# EAGLE design Mega_Shield-cjd (EAGLE 7.5.0)
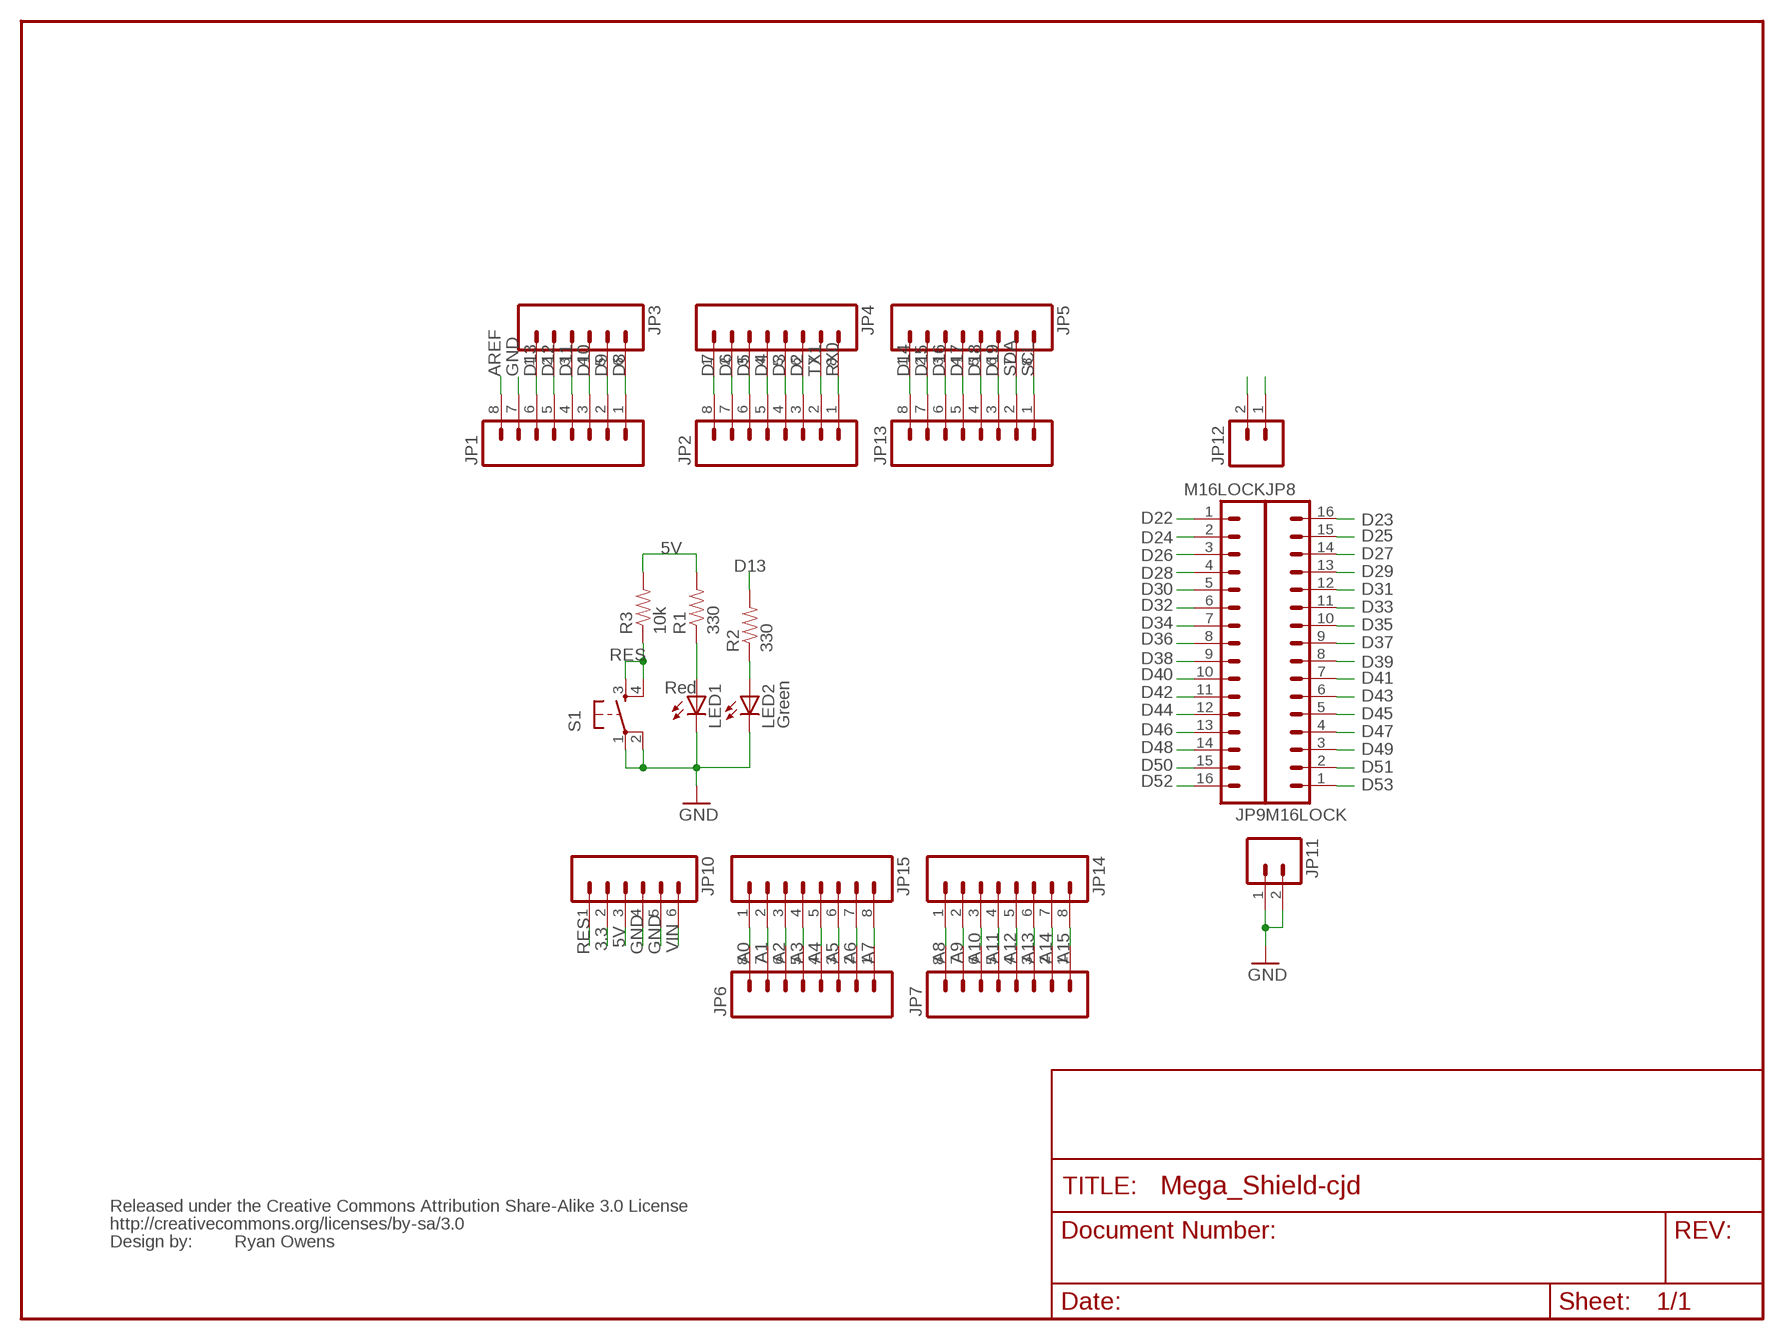
[diagram p0: schematic, sheet 1]

## Parts
JP1  M081X08_LOCK_NO_PIN1  [1X08_LOCK_NO_PIN1]
JP2  M081X08_LOCK_NO_PIN1  [1X08_LOCK_NO_PIN1]
JP3  M06NO_SILK_FEMALE_PTH  [1X06_NO_SILK]
JP4  M08NO_SILK_FEMALE_PTH  [1X08_NO_SILK]
JP5  M08NO_SILK_FEMALE_PTH  [1X08_NO_SILK]
JP6  M08NO_SILK_FEMALE_PTH  [1X08_NO_SILK]
JP7  M08NO_SILK_FEMALE_PTH  [1X08_NO_SILK]
JP8  M16LOCK  [1X16_LOCK]
JP9  M16LOCK  [1X16_LOCK]
JP10  M06LOCK  [1X06_LOCK]
JP11  M02LOCK  [1X02_LOCK]
JP12  M02LOCK  [1X02_LOCK]
JP13  M081X08_LOCK_NO_PIN1  [1X08_LOCK_NO_PIN1]
JP14  M081X08_LOCK_NO_PIN1  [1X08_LOCK_NO_PIN1]
JP15  M081X08_LOCK_NO_PIN1  [1X08_LOCK_NO_PIN1]
LED1  Red  LED5MM  [LED5MM]
LED2  Green  LED5MM  [LED5MM]
R1  330  RESISTORPTH1  [AXIAL-0.3]
R2  330  RESISTORPTH1  [AXIAL-0.3]
R3  10k  RESISTORPTH1  [AXIAL-0.3]
S1  TAC_SWITCHPTH  [TACTILE-PTH]
U$2  CREATIVE_COMMONS  [CREATIVE_COMMONS]

## Nets
3.3: JP10.2
5V: JP10.3 R1.P$2 R3.P$2
5V@1: JP12.1 JP12.2
A0: JP6.8 JP15.1
A1: JP6.7 JP15.2
A2: JP6.6 JP15.3
A3: JP6.5 JP15.4
A4: JP6.4 JP15.5
A5: JP6.3 JP15.6
A6: JP6.2 JP15.7
A7: JP6.1 JP15.8
A8: JP7.8 JP14.1
A9: JP7.7 JP14.2
A10: JP7.6 JP14.3
A11: JP7.5 JP14.4
A12: JP7.4 JP14.5
A13: JP7.3 JP14.6
A14: JP7.2 JP14.7
A15: JP7.1 JP14.8
AREF: JP1.8
D2: JP2.3 JP4.6
D3: JP2.4 JP4.5
D4: JP2.5 JP4.4
D5: JP2.6 JP4.3
D6: JP2.7 JP4.2
D7: JP2.8 JP4.1
D8: JP1.1 JP3.6
D9: JP1.2 JP3.5
D10: JP1.3 JP3.4
D11: JP1.4 JP3.3
D12: JP1.5 JP3.2
D13: JP1.6 JP3.1 R2.P$2
D14: JP5.1 JP13.8
D15: JP5.2 JP13.7
D16: JP5.3 JP13.6
D17: JP5.4 JP13.5
D18: JP5.5 JP13.4
D19: JP5.6 JP13.3
D22: JP9.1
D23: JP8.16
D24: JP9.2
D25: JP8.15
D26: JP9.3
D27: JP8.14
D28: JP9.4
D29: JP8.13
D30: JP9.5
D31: JP8.12
D32: JP9.6
D33: JP8.11
D34: JP9.7
D35: JP8.10
D36: JP9.8
D37: JP8.9
D38: JP9.9
D39: JP8.8
D40: JP9.10
D41: JP8.7
D42: JP9.11
D43: JP8.6
D44: JP9.12
D45: JP8.5
D46: JP9.13
D47: JP8.4
D48: JP9.14
D49: JP8.3
D50: JP9.15
D51: JP8.2
D52: JP9.16
D53: JP8.1
GND: JP1.7 JP10.4 JP10.5 JP11.1 JP11.2 LED1.K(C) LED2.K(C) S1.1 S1.2
N$126: LED1.A R1.P$1
N$127: LED2.A R2.P$1
RES: JP10.1 R3.P$1 S1.3 S1.4
RX0: JP2.1 JP4.8
SCL: JP5.8 JP13.1
SDA: JP5.7 JP13.2
TX1: JP2.2 JP4.7
VIN: JP10.6

## Notes on the sheet
- Ryan Owens

## Library data of the parts
JP1 JP2 JP13-JP15 = SparkFun-Connectors:M08: Header 8 Standard 8-pin 0.1" header. Use with straight break away headers (SKU : PRT-00116), right angle break away headers (PRT-00553), swiss pins (PRT-00743), machine pins (PRT-00117), and female headers (PRT-00115).
JP3 = SparkFun-Connectors:M06: Header 6 Standard 6-pin 0.1" header. Use with straight break away headers (SKU : PRT-00116), right angle break away headers (PRT-00553), swiss pins (PRT-00743), machine pins (PRT-00117), and female headers (PRT-00115). Molex polarized connector foot print use with SKU : PRT-08094 with associated ...; PROD_ID: CONN-08437
JP4-JP7 = SparkFun-Connectors:M08: Header 8 Standard 8-pin 0.1" header. Use with straight break away headers (SKU : PRT-00116), right angle break away headers (PRT-00553), swiss pins (PRT-00743), machine pins (PRT-00117), and female headers (PRT-00115).; PROD_ID: CONN-08438
JP8 JP9 = SparkFun:M16
JP10 = SparkFun:M06: Header 6 Standard 6-pin 0.1" header. Use with straight break away headers (SKU : PRT-00116), right angle break away headers (PRT-00553), swiss pins (PRT-00743), machine pins (PRT-00117), and female headers (PRT-00115). Molex polarized connector foot print use with SKU : PRT-08094 with associated ...
JP11 JP12 = SparkFun:M02: Header 2 Standard 2-pin 0.1" header. Use with straight break away headers (SKU : PRT-00116), right angle break away headers (PRT-00553), swiss pins (PRT-00743), machine pins (PRT-00117), and female headers (PRT-00115). Molex polarized connector foot print use with SKU : PRT-08233 with associated crimp pins and housings.
LED1 LED2 = SparkFun:LED: LEDs Standard schematic elements and footprints for 5mm, 3mm, 1206, and 0603 sized LEDs. 5mm - Spark Fun Electronics SKU : COM-00529 (and others)
R1-R3 = SparkFun:RESISTOR: Resistor Basic schematic elements and footprints for 0603, 1206, and PTH 1/10th watt (small) resistors.
S1 = SparkFun:TAC_SWITCH: Momentary Switch Button commonly used for reset or general input. Spark Fun Electronics SKU : COM-00097
U$2 = SparkFun:CREATIVE_COMMONS

## Board
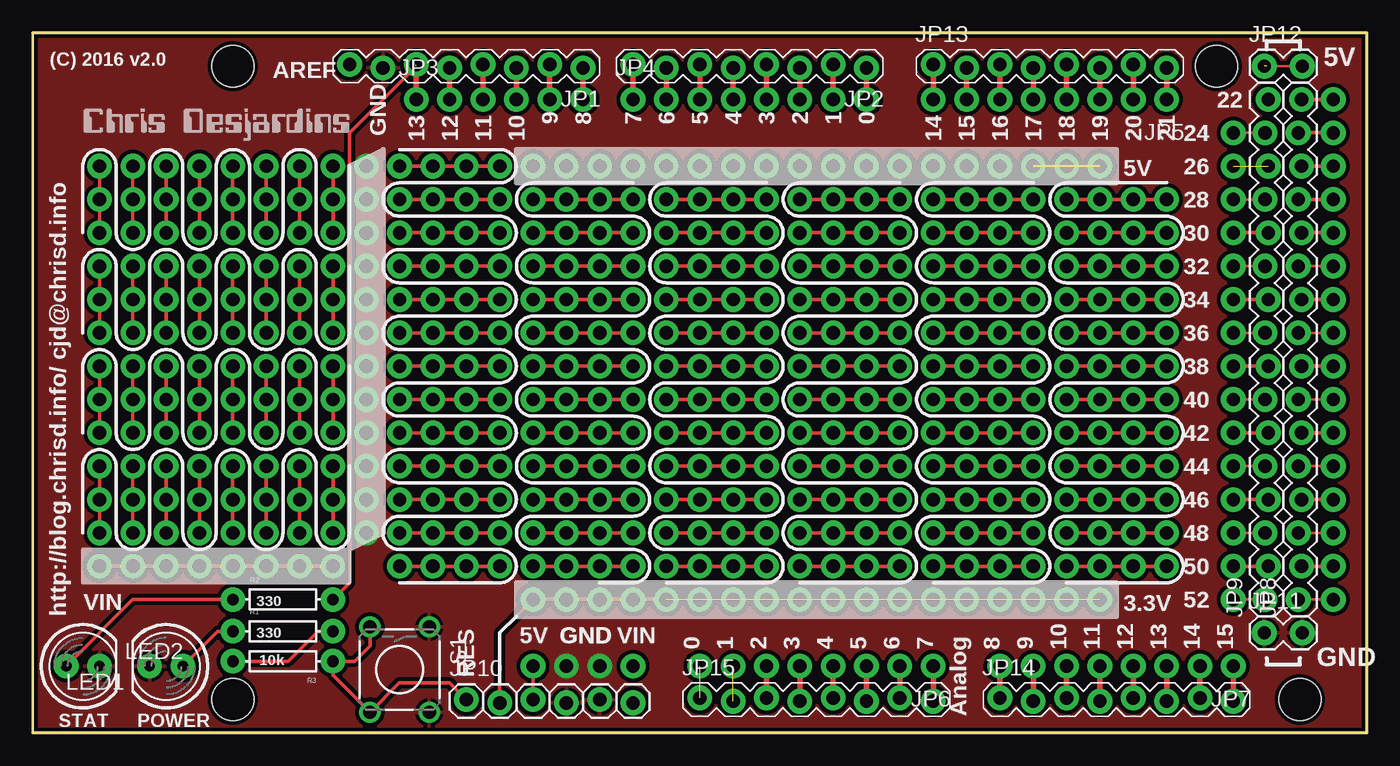
[diagram p1: board, top side]
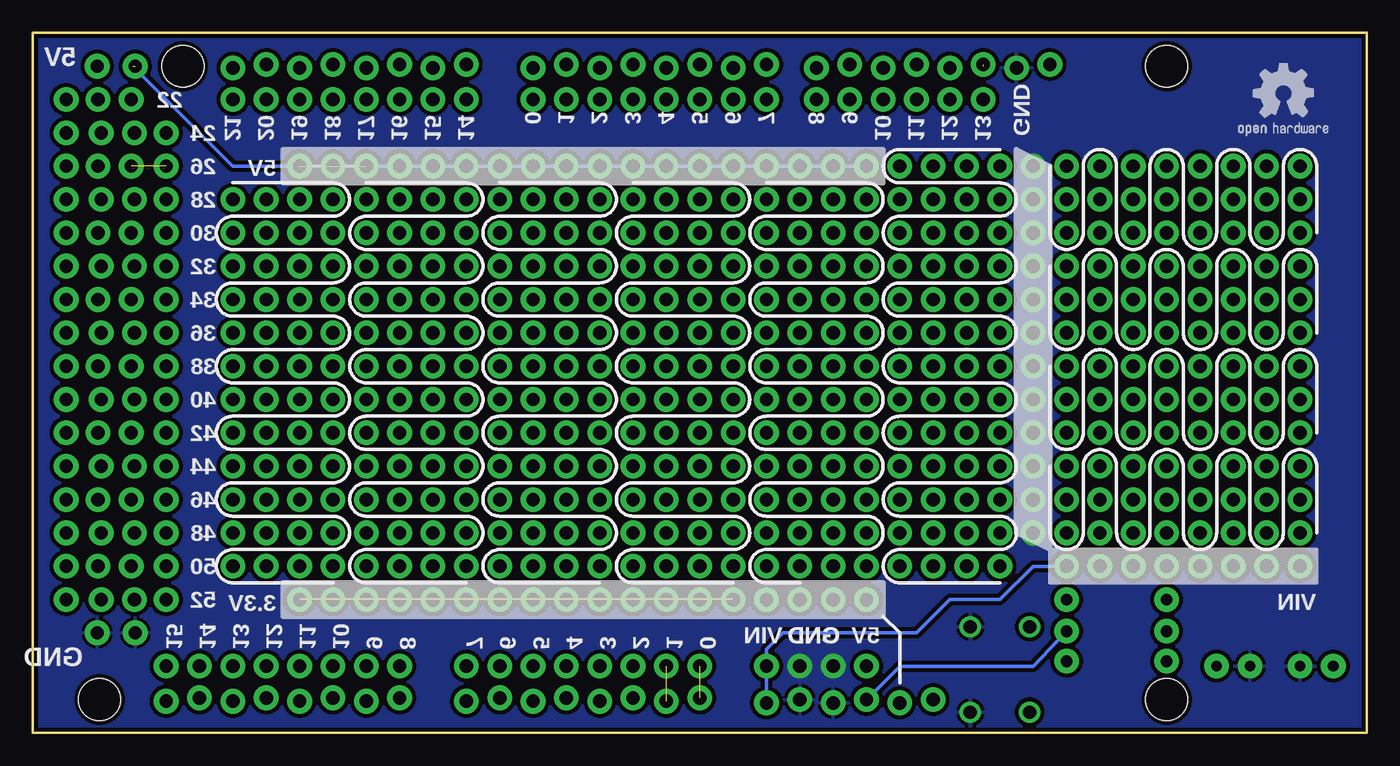
[diagram p2: board, bottom side, seen from below]

Size 101.6 x 53.34 mm. Coordinates in mm from the lower left corner, seen from the top.
Outline: 0,0 101.6,0 101.6,53.34 0,53.34 0,0
Copper layers (1*16): Top 0.035mm / dielectric 1.5mm / Bottom 0.035mm
Design rules "default": minimum track width 8mil, minimum drill 20mil, track to track 8mil, track to pad 8mil, pad to pad 8mil, via to via 8mil, smd to smd 8mil, copper to edge 10mil, drill to drill 8mil, minimum pad ring 12mil, minimum via ring 10mil, stop-mask expansion 4mil, vias tented up to drill 25mil, thermal gap 10mil
Holes 3.2 mm at 15.24,50.8 15.24,2.54 90.17,50.8 96.52,2.54

### Footprints (pad centres in the part's own frame; a part is rotated, then mirrored left to right if it is on the bottom)
1X08_LOCK_NO_PIN1 = drill 1.016 pad 1.88: 1 0,0.127; 2 2.54,-0.127; 3 5.08,0.127; 4 7.62,-0.127; 5 10.16,0.127; 6 12.7,-0.127; 7 15.24,0.127; 8 17.78,-0.127
1X06_NO_SILK = drill 1.016 pad 1.88: 1 0,0; 2 2.54,0; 3 5.08,0; 4 7.62,0; 5 10.16,0; 6 12.7,0
1X08_NO_SILK = drill 1.016 pad 1.88: 1 0,0; 2 2.54,0; 3 5.08,0; 4 7.62,0; 5 10.16,0; 6 12.7,0; 7 15.24,0; 8 17.78,0
1X16_LOCK = drill 1.016 pad 1.88: 1 0,0.127; 2 2.54,-0.127; 3 5.08,0.127; 4 7.62,-0.127; 5 10.16,0.127; 6 12.7,-0.127; 7 15.24,0.127; 8 17.78,-0.127; 9 20.32,0.127; 10 22.86,-0.127; 11 25.4,0.127; 12 27.94,-0.127; 13 30.48,0.127; 14 33.02,-0.127; 15 35.56,0.127; 16 38.1,-0.127
1X06_LOCK = drill 1.016 pad 1.88: 1 0,0; 2 2.54,-0.254; 3 5.08,0; 4 7.62,-0.254; 5 10.16,0; 6 12.7,-0.254
1X02_LOCK = drill 1.016 pad 1.88: 1 -0.178,0; 2 2.718,0
LED5MM = drill 0.813 pad 1.88: A -1.27,0; K 1.27,0
AXIAL-0.3 = drill 0.9 pad 1.88: P$1 -3.81,0; P$2 3.81,0
TACTILE-PTH = drill 1.016: 1 -3.251,2.261; 2 3.251,2.261; 3 -3.251,-2.261; 4 3.251,-2.261

### Placement (x,y rotation side)
JP1  41.91,50.8 180 top
JP2  63.5,50.8 180 top
JP3  29.21,48.26 0 top
JP4  45.72,48.26 0 top
JP5  86.36,48.26 180 top
JP6  68.58,5.08 180 top
JP7  91.44,5.08 180 top
JP8  96.52,10.16 90 top
JP9  93.98,10.16 90 top
JP10  33.02,2.54 0 top
JP11  93.98,7.62 0 top
JP12  93.98,50.8 0 top
JP13  68.58,50.8 0 top
JP14  73.66,2.54 0 top
JP15  50.8,2.54 0 top
LED1  10.16,5.08 180 top
LED2  3.81,5.08 0 top
R1  19.05,7.75 0 top
R2  19.05,10.16 0 top
R3  19.05,5.46 180 top
S1  27.94,4.83 270 top
U$1  [LOGO]  3.81,45.72 0 top
U$2  20.32,-7.62 0 top  (outside the outline)
U$3  [OSHW2]  10.16,44.45 0 bottom

### Tracks (layer width: path | path; a pad name or v marks a point on that pad's centre or on a via)
3.3  (via drill 1.02 pad 1.88)  (13 unrouted)
  Top 0.203: JP10.2 35.56,2.54
  Top 0.254: 35.56,2.54 35.56,7.62 v38.1,10.16 v40.64,10.16 v43.18,10.16 v45.72,10.16 v48.26,10.16
  other vias: 50.8,10.16 53.34,10.16 55.88,10.16 58.42,10.16 60.96,10.16 63.5,10.16 66.04,10.16 68.58,10.16 71.12,10.16 73.66,10.16 76.2,10.16 78.74,10.16 81.28,10.16
5V  (via drill 1.02 pad 1.88)
  Top 0.254: R3.P$2 19.43,5.46 21.72,7.75 R1.P$2 | JP10.3 v38.1,5.08
  Bottom 0.254: R1.P$2 25.4,5.08 35.56,5.08 JP10.3
5V@1  (via drill 1.02 pad 1.88)  (3 unrouted)
  Top 0.203: JP12.2 JP12.1
  Bottom 0.254: 93.98,50.8 86.36,43.18 v76.2,43.18 v73.66,43.18 v71.12,43.18 v68.58,43.18 v66.04,43.18 v63.5,43.18 v60.96,43.18 v58.42,43.18 v55.88,43.18 v53.34,43.18 v50.8,43.18 v48.26,43.18 v45.72,43.18 v43.18,43.18 v40.64,43.18 v38.1,43.18
  other vias: 78.74,43.18 81.28,43.18
A0  (1 unrouted)
A1  (1 unrouted)
A2
  Top 0.406: JP6.6 JP15.3
A3
  Top 0.406: JP15.4 JP6.5
A4
  Top 0.406: JP6.4 JP15.5
A5
  Top 0.406: JP15.6 JP6.3
A6
  Top 0.406: JP6.2 JP15.7
A7
  Top 0.406: JP15.8 JP6.1
A8
  Top 0.406: JP7.8 JP14.1
A9
  Top 0.406: JP14.2 JP7.7
A10
  Top 0.406: JP7.6 JP14.3
A11
  Top 0.406: JP14.4 JP7.5
A12
  Top 0.406: JP7.4 JP14.5
A13
  Top 0.406: JP7.3 JP14.6
A14
  Top 0.406: JP7.2 JP14.7
A15
  Top 0.406: JP14.8 JP7.1
D2
  Top 0.406: JP2.3 JP4.6
D3
  Top 0.406: JP4.5 JP2.4
D4
  Top 0.406: JP2.5 JP4.4
D5
  Top 0.406: JP4.3 JP2.6
D6
  Top 0.406: JP2.7 JP4.2
D7
  Top 0.406: JP4.1 JP2.8
D8
  Top 0.406: JP1.1 JP3.6
D9
  Top 0.406: JP3.5 JP1.2
D10
  Top 0.406: JP1.3 JP3.4
D11
  Top 0.406: JP3.3 JP1.4
D12
  Top 0.406: JP1.5 JP3.2
D13  (1 unrouted)
  Top 0.254: R2.P$2 24.13,11.43 24.13,45.72 29.21,50.8
  Top 0.406: JP3.1 JP1.6
D14
  Top 0.406: JP13.8 JP5.1
D15
  Top 0.406: JP13.7 JP5.2
D16
  Top 0.406: JP13.6 JP5.3
D17
  Top 0.406: JP13.5 JP5.4
D18
  Top 0.406: JP13.4 JP5.5
D19
  Top 0.406: JP5.6 JP13.3
D22  (via drill 1.02 pad 1.88)
  Top 0.203: JP9.1 v91.44,10.16
D23  (via drill 1.02 pad 1.88)
  Top 0.254: JP8.16 v99.06,48.26
D24  (via drill 1.02 pad 1.88)
  Top 0.254: JP9.2 v91.44,12.7
D25  (via drill 1.02 pad 1.88)
  Top 0.254: JP8.15 v99.06,45.72
D26  (via drill 1.02 pad 1.88)
  Top 0.203: JP9.3 v91.44,15.24
D27  (via drill 1.02 pad 1.88)
  Top 0.254: JP8.14 v99.06,43.18
D28  (via drill 1.02 pad 1.88)
  Top 0.254: JP9.4 v91.44,17.78
D29  (via drill 1.02 pad 1.88)
  Top 0.254: JP8.13 v99.06,40.64
D30  (via drill 1.02 pad 1.88)
  Top 0.203: JP9.5 v91.44,20.32
D31  (via drill 1.02 pad 1.88)
  Top 0.254: JP8.12 v99.06,38.1
D32  (via drill 1.02 pad 1.88)
  Top 0.254: JP9.6 v91.44,22.86
D33  (via drill 1.02 pad 1.88)
  Top 0.203: JP8.11 v99.06,35.56
D34  (via drill 1.02 pad 1.88)
  Top 0.203: JP9.7 v91.44,25.4
D35  (via drill 1.02 pad 1.88)
  Top 0.254: JP8.10 v99.06,33.02
D36  (via drill 1.02 pad 1.88)
  Top 0.254: JP9.8 v91.44,27.94
D37  (via drill 1.02 pad 1.88)
  Top 0.203: JP8.9 v99.06,30.48
D38  (via drill 1.02 pad 1.88)
  Top 0.203: JP9.9 v91.44,30.48
D39  (via drill 1.02 pad 1.88)
  Top 0.254: JP8.8 v99.06,27.94
D40  (via drill 1.02 pad 1.88)
  Top 0.254: JP9.10 v91.44,33.02
D41  (via drill 1.02 pad 1.88)
  Top 0.203: JP8.7 v99.06,25.4
D42  (via drill 1.02 pad 1.88)
  Top 0.203: JP9.11 v91.44,35.56
D43  (via drill 1.02 pad 1.88)
  Top 0.254: JP8.6 v99.06,22.86
D44  (via drill 1.02 pad 1.88)
  Top 0.254: JP9.12 v91.44,38.1
D45  (via drill 1.02 pad 1.88)
  Top 0.203: JP8.5 v99.06,20.32
D46  (via drill 1.02 pad 1.88)
  Top 0.203: JP9.13 v91.44,40.64
D47  (via drill 1.02 pad 1.88)
  Top 0.254: JP8.4 v99.06,17.78
D48  (via drill 1.02 pad 1.88)  (1 unrouted)
  other vias: 91.44,43.18
D49  (via drill 1.02 pad 1.88)
  Top 0.203: JP8.3 v99.06,15.24
D50  (via drill 1.02 pad 1.88)
  Top 0.203: JP9.15 v91.44,45.72
D51  (via drill 1.02 pad 1.88)
  Top 0.254: JP8.2 v99.06,12.7
D53  (via drill 1.02 pad 1.88)
  Top 0.203: JP8.1 v99.06,10.16
GND  (via drill 1.02 pad 1.88)
  other vias: 43.18,5.08 40.64,5.08 25.4,15.24 25.4,17.78 25.4,20.32 25.4,22.86 25.4,25.4 25.4,27.94 25.4,30.48 25.4,33.02 25.4,35.56 25.4,38.1 25.4,40.64 25.4,43.18
  pour Bottom (isolate 0.305): 0,0 101.6,0 101.6,53.34 0,53.34
  pour Top (isolate 0.305): 0,0 101.6,0 101.6,53.34 0,53.34
N$1  (via drill 1.02 pad 1.88)
  Top 0.254: v12.7,35.56 v12.7,33.02 v12.7,30.48
N$4  (via drill 1.02 pad 1.88)
  Top 0.254: v15.24,35.56 v15.24,33.02 v15.24,30.48
N$5  (via drill 1.02 pad 1.88)
  Top 0.254: v86.36,27.94 v83.82,27.94 v81.28,27.94 v78.74,27.94
N$6  (via drill 1.02 pad 1.88)
  Top 0.254: v17.78,35.56 v17.78,33.02 v17.78,30.48
N$7  (via drill 1.02 pad 1.88)
  Top 0.254: v86.36,22.86 v83.82,22.86 v81.28,22.86 v78.74,22.86
N$8  (via drill 1.02 pad 1.88)
  Top 0.254: v20.32,35.56 v20.32,33.02 v20.32,30.48
N$9  (via drill 1.02 pad 1.88)
  Top 0.254: v76.2,15.24 v73.66,15.24 v71.12,15.24 v68.58,15.24
N$10  (via drill 1.02 pad 1.88)
  Top 0.254: v22.86,35.56 v22.86,33.02 v22.86,30.48
N$11  (via drill 1.02 pad 1.88)
  Top 0.254: v86.36,17.78 v83.82,17.78 v81.28,17.78 v78.74,17.78
N$13  (via drill 1.02 pad 1.88)
  Top 0.254: v22.86,27.94 v22.86,25.4 v22.86,22.86
N$14  (via drill 1.02 pad 1.88)
  Top 0.254: v17.78,27.94 v17.78,25.4 v17.78,22.86
N$15  (via drill 1.02 pad 1.88)
  Top 0.254: v5.08,27.94 v5.08,25.4 v5.08,22.86
N$16  (via drill 1.02 pad 1.88)
  Top 0.254: v5.08,20.32 v5.08,17.78 v5.08,15.24
N$17  (via drill 1.02 pad 1.88)
  Top 0.254: v7.62,20.32 v7.62,17.78 v7.62,15.24
N$19  (via drill 1.02 pad 1.88)
  Top 0.254: v20.32,27.94 v20.32,25.4 v20.32,22.86
N$21  (via drill 1.02 pad 1.88)
  Top 0.254: v7.62,27.94 v7.62,25.4 v7.62,22.86
N$22  (via drill 1.02 pad 1.88)
  Top 0.254: v10.16,27.94 v10.16,25.4 v10.16,22.86
N$23  (via drill 1.02 pad 1.88)
  Top 0.254: v20.32,43.18 v20.32,40.64 v20.32,38.1
N$27  (via drill 1.02 pad 1.88)
  Top 0.254: v78.74,15.24 v81.28,15.24 v83.82,15.24 v86.36,15.24
N$29  (via drill 1.02 pad 1.88)
  Top 0.254: v78.74,20.32 v81.28,20.32 v83.82,20.32 v86.36,20.32
N$31  (via drill 1.02 pad 1.88)
  Top 0.254: v78.74,25.4 v81.28,25.4 v83.82,25.4 v86.36,25.4
N$33  (via drill 1.02 pad 1.88)
  Top 0.254: v78.74,30.48 v81.28,30.48 v83.82,30.48 v86.36,30.48
N$35  (via drill 1.02 pad 1.88)
  Top 0.254: v78.74,35.56 v81.28,35.56 v83.82,35.56 v86.36,35.56
N$38  (via drill 1.02 pad 1.88)
  Top 0.254: v10.16,20.32 v10.16,17.78 v10.16,15.24
N$40  (via drill 1.02 pad 1.88)
  Top 0.254: v12.7,27.94 v12.7,25.4 v12.7,22.86
N$41  (via drill 1.02 pad 1.88)
  Top 0.254: v15.24,27.94 v15.24,25.4 v15.24,22.86
N$42  (via drill 1.02 pad 1.88)
  Top 0.254: v35.56,38.1 v33.02,38.1 v30.48,38.1 v27.94,38.1
N$43  (via drill 1.02 pad 1.88)
  Top 0.254: v12.7,20.32 v12.7,17.78 v12.7,15.24
N$45  (via drill 1.02 pad 1.88)
  Top 0.254: v15.24,20.32 v15.24,17.78 v15.24,15.24
N$46  (via drill 1.02 pad 1.88)
  Top 0.254: v17.78,20.32 v17.78,17.78 v17.78,15.24
N$48  (via drill 1.02 pad 1.88)
  Top 0.254: v76.2,20.32 v73.66,20.32 v71.12,20.32 v68.58,20.32
N$49  (via drill 1.02 pad 1.88)
  Top 0.254: v20.32,20.32 v20.32,17.78 v20.32,15.24
N$51  (via drill 1.02 pad 1.88)
  Top 0.254: v76.2,25.4 v73.66,25.4 v71.12,25.4 v68.58,25.4
N$53  (via drill 1.02 pad 1.88)
  Top 0.254: v76.2,30.48 v73.66,30.48 v71.12,30.48 v68.58,30.48
N$54  (via drill 1.02 pad 1.88)
  Top 0.254: v76.2,33.02 v73.66,33.02 v71.12,33.02 v68.58,33.02
N$56  (via drill 1.02 pad 1.88)
  Top 0.254: v68.58,12.7 v71.12,12.7 v73.66,12.7 v76.2,12.7
N$58  (via drill 1.02 pad 1.88)
  Top 0.254: v68.58,17.78 v71.12,17.78 v73.66,17.78 v76.2,17.78
N$59  (via drill 1.02 pad 1.88)
  Top 0.254: v22.86,20.32 v22.86,17.78 v22.86,15.24
N$61  (via drill 1.02 pad 1.88)
  Top 0.254: v86.36,12.7 v83.82,12.7 v81.28,12.7 v78.74,12.7
N$62  (via drill 1.02 pad 1.88)
  Top 0.254: v68.58,22.86 v71.12,22.86 v73.66,22.86 v76.2,22.86
N$65  (via drill 1.02 pad 1.88)
  Top 0.254: v86.36,33.02 v83.82,33.02 v81.28,33.02 v78.74,33.02
N$66  (via drill 1.02 pad 1.88)
  Top 0.254: v68.58,27.94 v71.12,27.94 v73.66,27.94 v76.2,27.94
N$68  (via drill 1.02 pad 1.88)
  Top 0.254: v86.36,38.1 v83.82,38.1 v81.28,38.1 v78.74,38.1
N$71  (via drill 1.02 pad 1.88)
  Top 0.254: v78.74,40.64 v81.28,40.64 v83.82,40.64 v86.36,40.64
N$72  (via drill 1.02 pad 1.88)
  Top 0.254: v76.2,38.1 v73.66,38.1 v71.12,38.1 v68.58,38.1
N$76  (via drill 1.02 pad 1.88)
  Top 0.254: v68.58,35.56 v71.12,35.56 v73.66,35.56 v76.2,35.56
N$87  (via drill 1.02 pad 1.88)
  Top 0.254: v58.42,12.7 v60.96,12.7 v63.5,12.7 v66.04,12.7
N$88  (via drill 1.02 pad 1.88)
  Top 0.254: v58.42,15.24 v60.96,15.24 v63.5,15.24 v66.04,15.24
N$89  (via drill 1.02 pad 1.88)
  Top 0.254: v58.42,17.78 v60.96,17.78 v63.5,17.78 v66.04,17.78
N$90  (via drill 1.02 pad 1.88)
  Top 0.254: v58.42,20.32 v60.96,20.32 v63.5,20.32 v66.04,20.32
N$91  (via drill 1.02 pad 1.88)
  Top 0.254: v58.42,22.86 v60.96,22.86 v63.5,22.86 v66.04,22.86
N$92  (via drill 1.02 pad 1.88)
  Top 0.254: v58.42,25.4 v60.96,25.4 v63.5,25.4 v66.04,25.4
N$93  (via drill 1.02 pad 1.88)
  Top 0.254: v58.42,27.94 v60.96,27.94 v63.5,27.94 v66.04,27.94
N$94  (via drill 1.02 pad 1.88)
  Top 0.254: v58.42,30.48 v60.96,30.48 v63.5,30.48 v66.04,30.48
N$95  (via drill 1.02 pad 1.88)
  Top 0.254: v58.42,33.02 v60.96,33.02 v63.5,33.02 v66.04,33.02
N$96  (via drill 1.02 pad 1.88)
  Top 0.254: v58.42,35.56 v60.96,35.56 v63.5,35.56 v66.04,35.56
N$97  (via drill 1.02 pad 1.88)
  Top 0.254: v55.88,12.7 v53.34,12.7 v50.8,12.7 v48.26,12.7
N$98  (via drill 1.02 pad 1.88)
  Top 0.254: v55.88,15.24 v53.34,15.24 v50.8,15.24 v48.26,15.24
N$99  (via drill 1.02 pad 1.88)
  Top 0.254: v55.88,17.78 v53.34,17.78 v50.8,17.78 v48.26,17.78
N$100  (via drill 1.02 pad 1.88)
  Top 0.254: v55.88,20.32 v53.34,20.32 v50.8,20.32 v48.26,20.32
N$101  (via drill 1.02 pad 1.88)
  Top 0.254: v55.88,22.86 v53.34,22.86 v50.8,22.86 v48.26,22.86
N$102  (via drill 1.02 pad 1.88)
  Top 0.254: v55.88,25.4 v53.34,25.4 v50.8,25.4 v48.26,25.4
N$103  (via drill 1.02 pad 1.88)
  Top 0.254: v55.88,27.94 v53.34,27.94 v50.8,27.94 v48.26,27.94
N$104  (via drill 1.02 pad 1.88)
  Top 0.254: v55.88,30.48 v53.34,30.48 v50.8,30.48 v48.26,30.48
N$105  (via drill 1.02 pad 1.88)
  Top 0.254: v55.88,33.02 v53.34,33.02 v50.8,33.02 v48.26,33.02
N$106  (via drill 1.02 pad 1.88)
  Top 0.254: v55.88,35.56 v53.34,35.56 v50.8,35.56 v48.26,35.56
N$109  (via drill 1.02 pad 1.88)
  Top 0.254: v68.58,40.64 v71.12,40.64 v73.66,40.64 v76.2,40.64
N$112  (via drill 1.02 pad 1.88)
  Top 0.254: v58.42,38.1 v60.96,38.1 v63.5,38.1 v66.04,38.1
N$113  (via drill 1.02 pad 1.88)
  Top 0.254: v58.42,40.64 v60.96,40.64 v63.5,40.64 v66.04,40.64
N$114  (via drill 1.02 pad 1.88)
  Top 0.254: v55.88,38.1 v53.34,38.1 v50.8,38.1 v48.26,38.1
N$115  (via drill 1.02 pad 1.88)
  Top 0.254: v55.88,40.64 v53.34,40.64 v50.8,40.64 v48.26,40.64
N$116  (via drill 1.02 pad 1.88)
  Top 0.254: v45.72,38.1 v43.18,38.1 v40.64,38.1 v38.1,38.1
N$117  (via drill 1.02 pad 1.88)
  Top 0.254: v45.72,12.7 v43.18,12.7 v40.64,12.7 v38.1,12.7
N$118  (via drill 1.02 pad 1.88)
  Top 0.254: v45.72,15.24 v43.18,15.24 v40.64,15.24 v38.1,15.24
N$119  (via drill 1.02 pad 1.88)
  Top 0.254: v45.72,17.78 v43.18,17.78 v40.64,17.78 v38.1,17.78
N$120  (via drill 1.02 pad 1.88)
  Top 0.254: v45.72,20.32 v43.18,20.32 v40.64,20.32 v38.1,20.32
N$121  (via drill 1.02 pad 1.88)
  Top 0.254: v45.72,22.86 v43.18,22.86 v40.64,22.86 v38.1,22.86
N$122  (via drill 1.02 pad 1.88)
  Top 0.254: v45.72,25.4 v43.18,25.4 v40.64,25.4 39.37,25.4 v38.1,25.4
N$123  (via drill 1.02 pad 1.88)
  Top 0.254: v45.72,27.94 v43.18,27.94 v40.64,27.94 v38.1,27.94
N$124  (via drill 1.02 pad 1.88)
  Top 0.254: v45.72,30.48 v43.18,30.48 v40.64,30.48 v38.1,30.48
N$125  (via drill 1.02 pad 1.88)
  Top 0.254: v45.72,33.02 v43.18,33.02 v40.64,33.02 v38.1,33.02
N$126
  Top 0.254: R1.P$1 14.1,7.75 LED1.A
N$127
  Top 0.254: R2.P$1 7.62,10.16 LED2.A
N$128  (via drill 1.02 pad 1.88)
  Top 0.254: v45.72,35.56 v43.18,35.56 v40.64,35.56 v38.1,35.56
N$136  (via drill 1.02 pad 1.88)
  Top 0.254: v45.72,40.64 v43.18,40.64 v40.64,40.64 v38.1,40.64
N$142  (via drill 1.02 pad 1.88)
  Top 0.254: v35.56,15.24 v33.02,15.24 v30.48,15.24 v27.94,15.24
N$143  (via drill 1.02 pad 1.88)
  Top 0.254: v35.56,17.78 v33.02,17.78 v30.48,17.78 v27.94,17.78
N$144  (via drill 1.02 pad 1.88)
  Top 0.254: v35.56,20.32 v33.02,20.32 v30.48,20.32 v27.94,20.32
N$145  (via drill 1.02 pad 1.88)
  Top 0.254: v35.56,22.86 v33.02,22.86 v30.48,22.86 v27.94,22.86
N$146  (via drill 1.02 pad 1.88)
  Top 0.254: v35.56,25.4 v33.02,25.4 v30.48,25.4 v27.94,25.4
N$147  (via drill 1.02 pad 1.88)
  Top 0.254: v35.56,27.94 v33.02,27.94 v30.48,27.94 v27.94,27.94
N$148  (via drill 1.02 pad 1.88)
  Top 0.254: v35.56,30.48 v33.02,30.48 v30.48,30.48 v27.94,30.48
N$149  (via drill 1.02 pad 1.88)
  Top 0.254: v35.56,33.02 v33.02,33.02 v30.48,33.02 v27.94,33.02
N$150  (via drill 1.02 pad 1.88)
  Top 0.254: v35.56,35.56 v33.02,35.56 v30.48,35.56 v27.94,35.56
N$161  (via drill 1.02 pad 1.88)
  Top 0.254: v35.56,12.7 v33.02,12.7 v30.48,12.7 v27.94,12.7
N$274  (via drill 1.02 pad 1.88)
  Top 0.254: v35.56,40.64 v33.02,40.64 v30.48,40.64 v27.94,40.64
N$276  (via drill 1.02 pad 1.88)
  Top 0.254: v35.56,43.18 v33.02,43.18 v30.48,43.18 v27.94,43.18
N$355  (via drill 1.02 pad 1.88)
  Top 0.254: v22.86,43.18 v22.86,40.64 v22.86,38.1
N$388  (via drill 1.02 pad 1.88)
  Top 0.254: v17.78,43.18 v17.78,40.64 v17.78,38.1
N$395  (via drill 1.02 pad 1.88)
  Top 0.254: v5.08,43.18 v5.08,40.64 v5.08,38.1
N$400  (via drill 1.02 pad 1.88)
  Top 0.254: v5.08,35.56 v5.08,33.02 v5.08,30.48
N$403  (via drill 1.02 pad 1.88)
  Top 0.254: v7.62,35.56 v7.62,33.02 v7.62,30.48
N$406  (via drill 1.02 pad 1.88)
  Top 0.254: v7.62,43.18 v7.62,40.64 v7.62,38.1
N$407  (via drill 1.02 pad 1.88)
  Top 0.254: v10.16,43.18 v10.16,40.64 v10.16,38.1
N$410  (via drill 1.02 pad 1.88)
  Top 0.254: v10.16,35.56 v10.16,33.02 v10.16,30.48
N$418  (via drill 1.02 pad 1.88)
  Top 0.254: v12.7,43.18 v12.7,40.64 v12.7,38.1
N$419  (via drill 1.02 pad 1.88)
  Top 0.254: v15.24,43.18 v15.24,40.64 v15.24,38.1
RES
  Top 0.254: JP10.1 31.75,3.81 27.91,3.81 S1.4 22.86,4.39 R3.P$1 24.51,5.46 25.68,6.63 S1.3
RX0
  Top 0.406: JP2.1 JP4.8
SCL
  Top 0.406: JP5.8 JP13.1
SDA
  Top 0.406: JP13.2 JP5.7
TX1
  Top 0.406: JP4.7 JP2.2
VIN  (via drill 1.02 pad 1.88)
  Top 0.254: v5.08,12.7 v7.62,12.7 v10.16,12.7 v12.7,12.7 v15.24,12.7 v17.78,12.7 v20.32,12.7 v22.86,12.7
  Bottom 0.254: v22.86,12.7 25.4,12.7 27.94,10.16 31.75,10.16 34.29,7.62 44.45,7.62 45.72,6.35 v45.72,5.08 JP10.6

### Text on the board
tPlace: (C) 2016 v2.0 | AREF | 5V | 22 | 9 | 8 | 7 | 6 | 5 | 4 | 3 | 2 | 1 | 0 | GND | 13 | 12 | 11 | 10 | 14 | 15 | 16 | 17 | 18 | 19 | 20 | 21 | 24 | 26 | 5V | 28 | 30 | 32 | 34 | 36 | 38 | 40 | 42 | 44 | 46 | 48 | 50 | 52 | http://blog.chrisd.info/ cjd@chrisd.info | VIN | 3.3V | 5V | GND | GND | GND | VIN | 0 | 1 | 2 | 3 | 4 | 5 | 6 | 7 | 8 | 9 | 10 | 11 | 12 | 13 | 14 | 15 | GND | RES | Analog | STAT | POWER
bPlace: 5V | 22 | 9 | 8 | 7 | 6 | 5 | 4 | 3 | 2 | 1 | 0 | GND | 13 | 12 | 11 | 10 | 14 | 15 | 16 | 17 | 18 | 19 | 20 | 21 | 24 | 26 | 5V | 28 | 30 | 32 | 34 | 36 | 38 | 40 | 42 | 44 | 46 | 48 | 50 | 52 | VIN | 3.3V | 5V | GND | GND | GND | VIN | 0 | 1 | 2 | 3 | 4 | 5 | 6 | 7 | 8 | 9 | 10 | 11 | 12 | 13 | 14 | 15 | GND